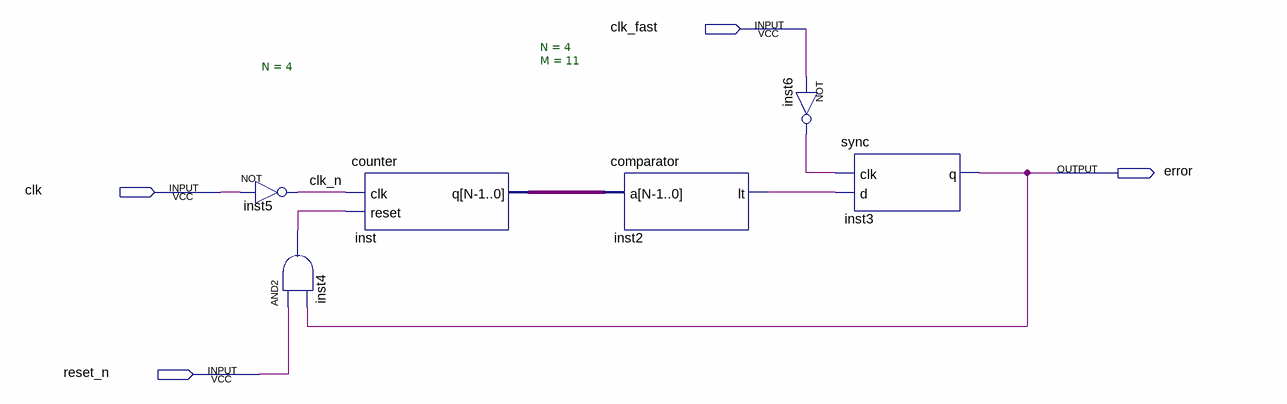
[diagram p0: schematic sheet]
// Quartus schematic error_check.bdf as structural Verilog: 6 symbols, 4 pins
module error_check (
  input  clk_fast,
  input  clk,
  input  reset_n,
  output error
);

  wire clk_n, inst2_lt, inst4_out, inst6_out;
  wire [3:0] inst_q;

  not inst5 (clk_n, clk);
  and inst4 (inst4_out, reset_n, error);
  counter #(.N(4)) inst (.clk(clk_n), .reset(inst4_out), .q(inst_q));
  comparator #(.N(4), .M(11)) inst2 (.a(inst_q), .lt(inst2_lt));
  not inst6 (inst6_out, clk_fast);
  sync inst3 (.clk(inst6_out), .d(inst2_lt), .q(error));
endmodule
